# Altium schematic sheet RS232_Module_3V3.SchDoc
size OrCAD A
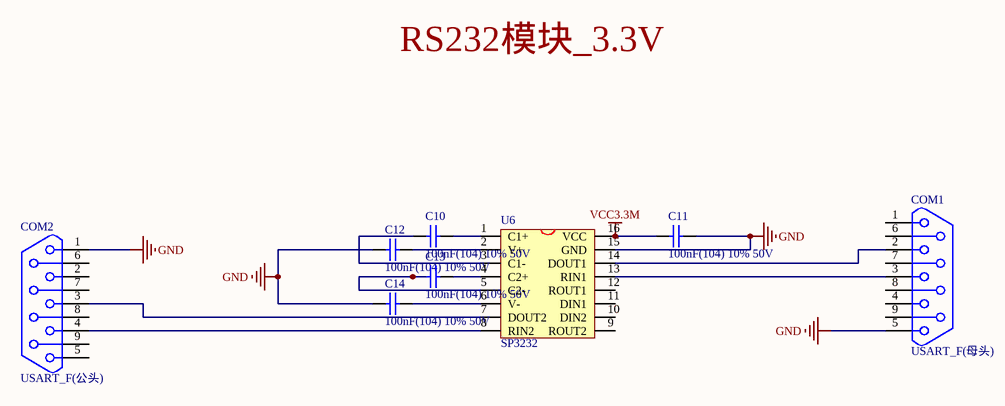
[diagram p0: RS232_Module_3V3.SchDoc]

## Parts
C10  100nF(104) 10% 50V  [0805_C]
C11  100nF(104) 10% 50V  [0805_C]
C12  100nF(104) 10% 50V  [0805_C]
C13  100nF(104) 10% 50V  [0805_C]
C14  100nF(104) 10% 50V  [0805_C]
COM1  USART_F(母头)  [DB9]
COM2  USART_F(公头)  [DB9]
U6  SP3232  [SOP16M]

## Nets
GND: C11.2 C12.1 C14.1 COM1.5 COM2.1 U6.15(GND)
VCC3.3M: C11.1 U6.16(VCC)
NetC10_1: C10.1 U6.3(C1-)
NetC10_2: C10.2 U6.1(C1+)
NetC12_2: C12.2 U6.2(V+)
NetC13_1: C13.1 U6.5(C2-)
NetC13_2: C13.2 U6.4(C2+)
NetC14_2: C14.2 U6.6(V-)
NetCOM1_2: COM1.2 U6.14(DOUT1)
NetCOM1_3: COM1.3 U6.13(RIN1)
NetCOM2_3: COM2.3 U6.7(DOUT2)
NetCOM2_4: COM2.4 U6.8(RIN2)

Not connected (* = marked no-connect by the designer): COM1 1 4 6 7 8 9; COM2 2 5 6 7 8 9; U6 9(ROUT2) 10(DIN2) 11(DIN1) 12(ROUT1)

## Notes on the sheet
- RS232模块_3.3V
- Title
- Size:
- Date:
- Orcad A
- Number:
- Time:
- Revision:
- Sheet
- of
- File:

## Library data of the parts
C10-C14 = 0805 100nF(104) 10% 50V: 贴片电容; ComponentLink1Description: 供应商链接; ComponentLink1URL: http://www.szlcsc.com/product/details_50686.html; Package: 0805; Supplier: LC; SuppliersPartNumber: C49678
COM1 COM2 = DB9
U6 = MAX3232